# Altium schematic sheet Memory.SchDoc
size A4
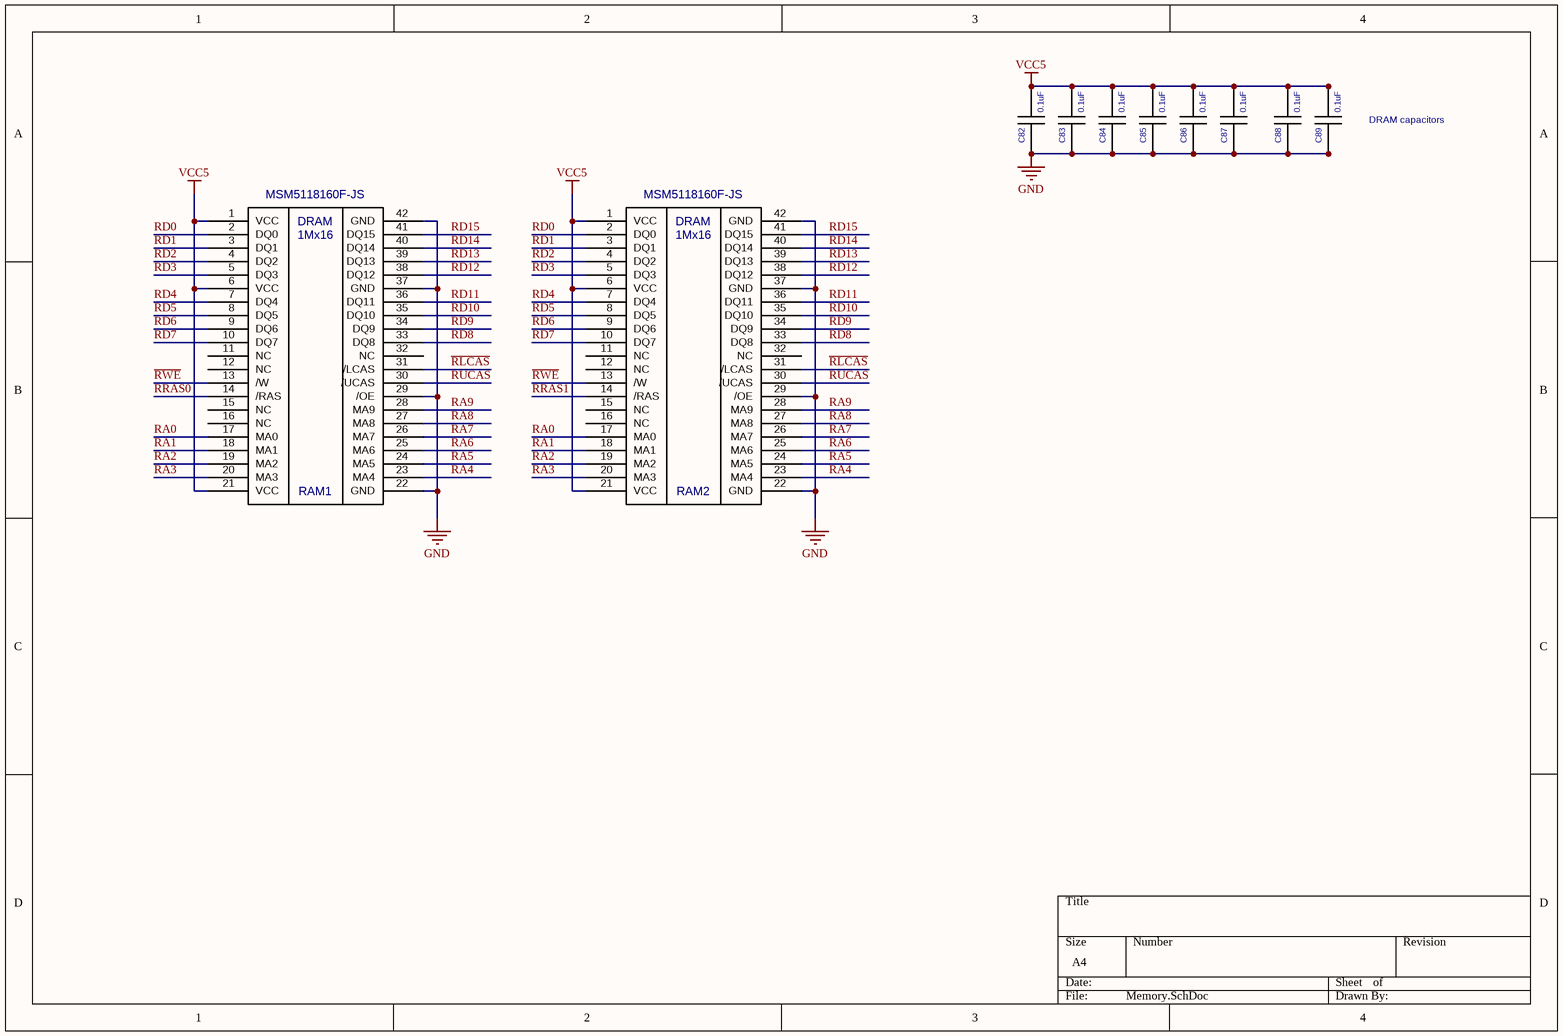
[diagram p0: Memory.SchDoc]

## Parts
C82  value 0.1uF  [C-CHIP]  (hidden comment: CAPCHIP)
C83  value 0.1uF  [C-CHIP]  (hidden comment: CAPCHIP)
C84  value 0.1uF  [C-CHIP]  (hidden comment: CAPCHIP)
C85  value 0.1uF  [C-CHIP]  (hidden comment: CAPCHIP)
C86  value 0.1uF  [C-CHIP]  (hidden comment: CAPCHIP)
C87  value 0.1uF  [C-CHIP]  (hidden comment: CAPCHIP)
C88  value 0.1uF  [C-CHIP]  (hidden comment: CAPCHIP)
C89  value 0.1uF  [C-CHIP]  (hidden comment: CAPCHIP)
RAM1  MSM5118160F-JS  [SOJ42]
RAM2  MSM5118160F-JS  [SOJ42]

## Nets
GND: C82.1 C83.1 C84.1 C85.1 C86.1 C87.1 C88.1 C89.1 RAM1.22(GND) RAM1.29(/OE) RAM1.37(GND) RAM1.42(GND) RAM2.22(GND) RAM2.29(/OE) RAM2.37(GND) RAM2.42(GND)
VCC5: C82.2 C83.2 C84.2 C85.2 C86.2 C87.2 C88.2 C89.2 RAM1.1(VCC) RAM1.6(VCC) RAM1.21(VCC) RAM2.1(VCC) RAM2.6(VCC) RAM2.21(VCC)
~{RLCAS}: RAM1.31(/LCAS) RAM2.31(/LCAS)
~{RRAS0}: RAM1.14(/RAS)
~{RRAS1}: RAM2.14(/RAS)
~{RUCAS}: RAM1.30(/UCAS) RAM2.30(/UCAS)
~{RWE}: RAM1.13(/W) RAM2.13(/W)
RA0: RAM1.17(MA0) RAM2.17(MA0)
RA1: RAM1.18(MA1) RAM2.18(MA1)
RA2: RAM1.19(MA2) RAM2.19(MA2)
RA3: RAM1.20(MA3) RAM2.20(MA3)
RA4: RAM1.23(MA4) RAM2.23(MA4)
RA5: RAM1.24(MA5) RAM2.24(MA5)
RA6: RAM1.25(MA6) RAM2.25(MA6)
RA7: RAM1.26(MA7) RAM2.26(MA7)
RA8: RAM1.27(MA8) RAM2.27(MA8)
RA9: RAM1.28(MA9) RAM2.28(MA9)
RD0: RAM1.2(DQ0) RAM2.2(DQ0)
RD1: RAM1.3(DQ1) RAM2.3(DQ1)
RD2: RAM1.4(DQ2) RAM2.4(DQ2)
RD3: RAM1.5(DQ3) RAM2.5(DQ3)
RD4: RAM1.7(DQ4) RAM2.7(DQ4)
RD5: RAM1.8(DQ5) RAM2.8(DQ5)
RD6: RAM1.9(DQ6) RAM2.9(DQ6)
RD7: RAM1.10(DQ7) RAM2.10(DQ7)
RD8: RAM1.33(DQ8) RAM2.33(DQ8)
RD9: RAM1.34(DQ9) RAM2.34(DQ9)
RD10: RAM1.35(DQ10) RAM2.35(DQ10)
RD11: RAM1.36(DQ11) RAM2.36(DQ11)
RD12: RAM1.38(DQ12) RAM2.38(DQ12)
RD13: RAM1.39(DQ13) RAM2.39(DQ13)
RD14: RAM1.40(DQ14) RAM2.40(DQ14)
RD15: RAM1.41(DQ15) RAM2.41(DQ15)

Not connected (* = marked no-connect by the designer): RAM1 11(NC) 12(NC) 15(NC) 16(NC) 32(NC); RAM2 11(NC) 12(NC) 15(NC) 16(NC) 32(NC)

## Notes on the sheet
- (near C89) DRAM capacitors
- (in symbol MSM5118160F-JS) DRAM; 1Mx16

## Library data of the parts
RAM1 RAM2 = MSM5118160F-JS: Value: *